# EAGLE design avr_programming_shield_Sockets - DaveO version (EAGLE 6.4)
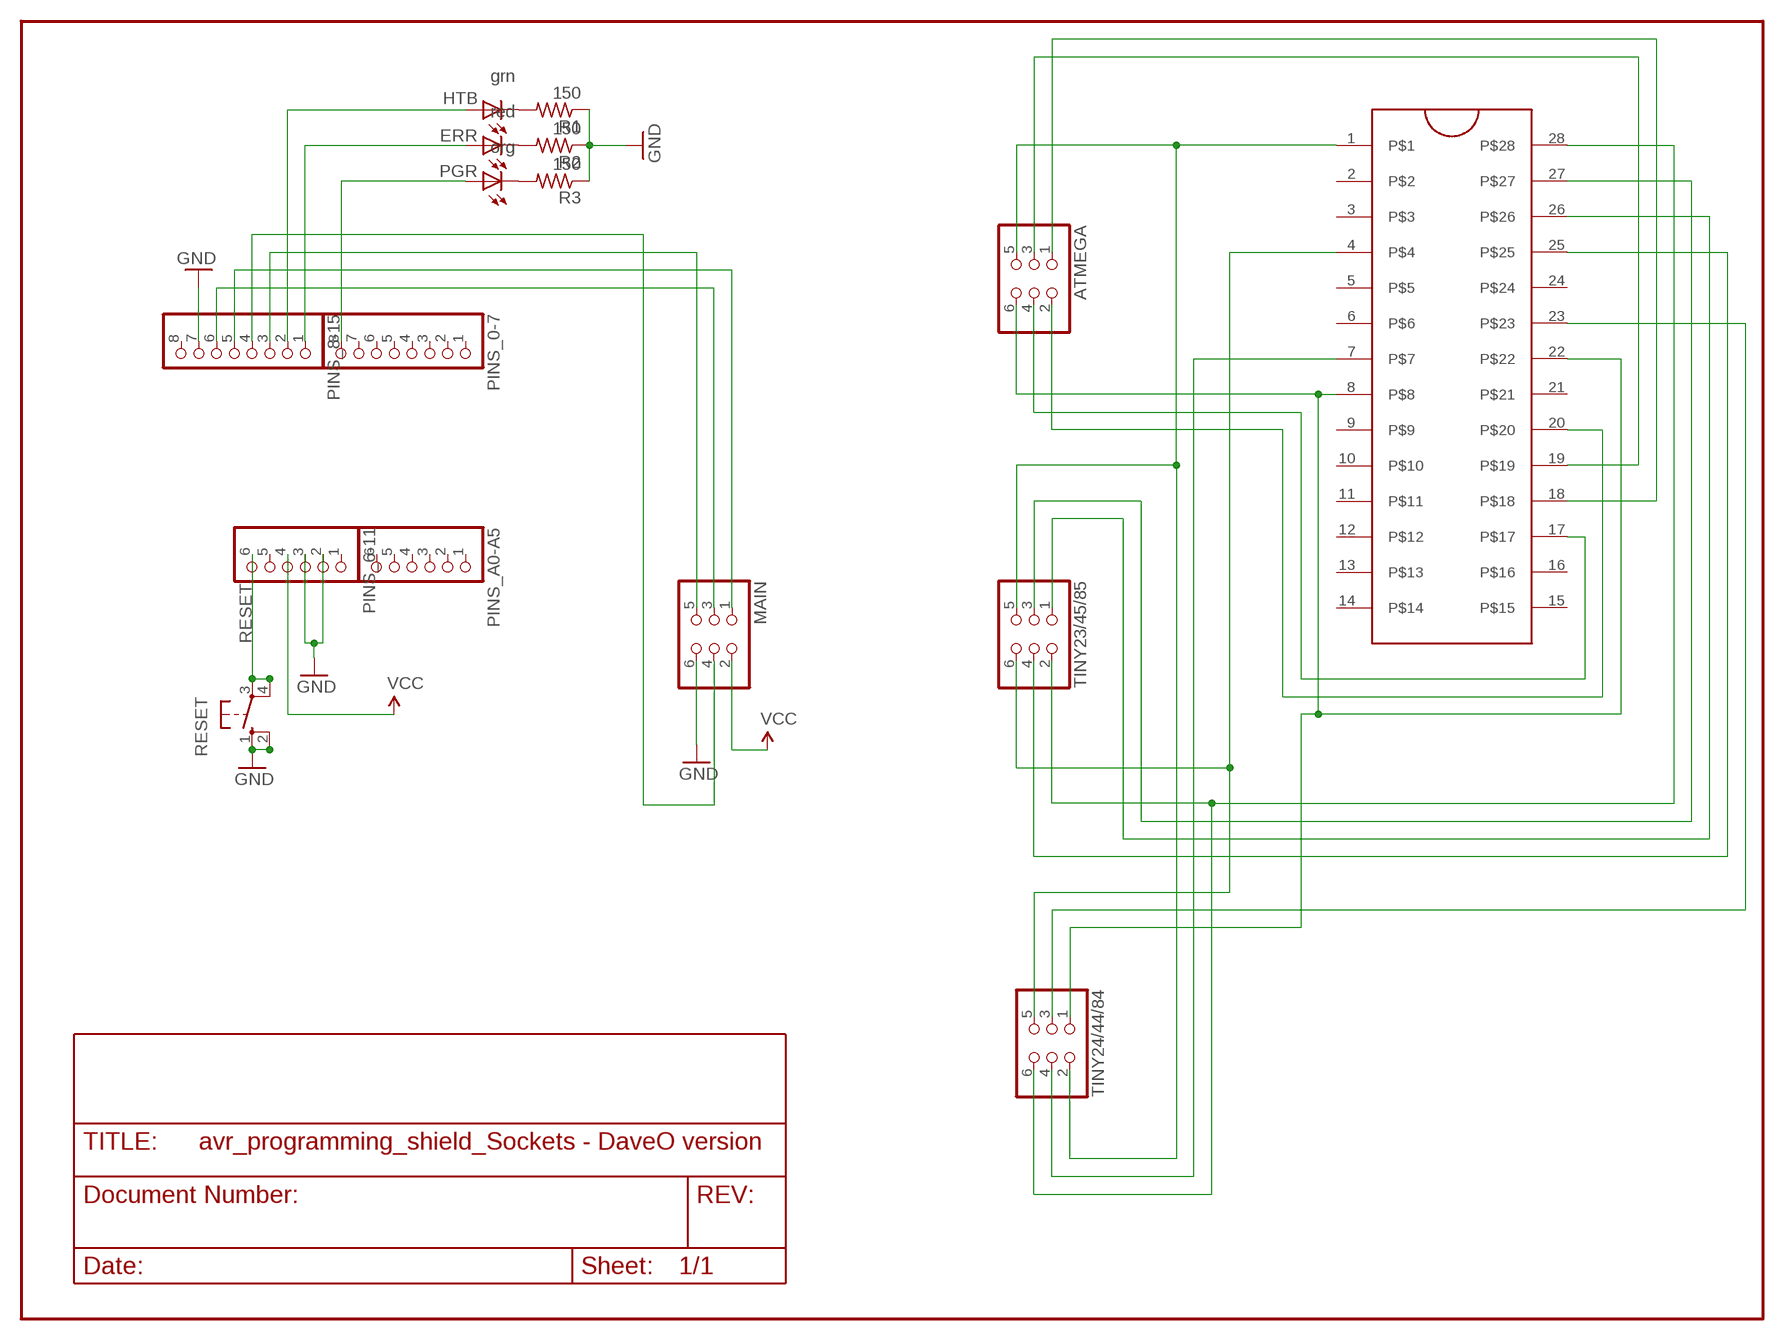
[diagram p0: schematic, sheet 1]

## Parts
ATMEGA  PINHD-2X3  [2X03]
ERR  red  LED3MM  [LED3MM]
HTB  grn  LED3MM  [LED3MM]
MAIN  PINHD-2X3  [2X03]
PGR  org  LED3MM  [LED3MM]
PINS_0-7  PINHD-1X8BIG  [1X08-BIG]
PINS_6-11  PINHD-1X6B  [1X06-BIG]
PINS_8-15  PINHD-1X8BIG  [1X08-BIG]
PINS_A0-A5  PINHD-1X6B  [1X06-BIG]
R1  150  R-US_0204/2V  [0204V]
R2  150  R-US_0204/2V  [0204V]
R3  150  R-US_0204/2V  [0204V]
RESET  10-XX  [B3F-10XX]
TINY23/45/85  PINHD-2X3  [2X03]
TINY24/44/84  PINHD-2X3  [2X03]
U$2  ZIFSOCKET-28-3ZIFFSOCKET-28-3  [DIL28-3-ZIF_SOCKET]

## Nets
328-GND: ATMEGA.6 TINY24/44/84.1 U$2.8 U$2.22
328-MISO: ATMEGA.1 U$2.18
328-SCK: ATMEGA.3 U$2.19
328-VCC: ATMEGA.2 U$2.20
GND [power]: MAIN.6 PINS_6-11.2 PINS_6-11.3 PINS_8-15.7 R1.1 R2.1 R3.1 RESET.1(S) RESET.2(S1)
MISO: MAIN.1 PINS_8-15.5
MOSI: MAIN.4 PINS_8-15.4
N$1: TINY23/45/85.3 U$2.27
N$2: TINY23/45/85.6 TINY24/44/84.5 U$2.4
N$3: ATMEGA.4 U$2.17
N$4: TINY23/45/85.4 U$2.25
N$5: ATMEGA.5 TINY23/45/85.5 TINY24/44/84.2 U$2.1
N$6: ERR.A PINS_8-15.1
N$7: TINY23/45/85.2 TINY24/44/84.6 U$2.28
N$8: HTB.K(C) R1.2
N$9: ERR.K(C) R2.2
N$10: PGR.K(C) R3.2
N$12: TINY23/45/85.1 U$2.26
N$13: PGR.A PINS_0-7.8
N$14: HTB.A PINS_8-15.2
N$16: TINY24/44/84.3 U$2.23
N$19: TINY24/44/84.4 U$2.7
RESET: PINS_6-11.6 RESET.3(P) RESET.4(P1)
RST: MAIN.5 PINS_8-15.3
SCK: MAIN.3 PINS_8-15.6
VCC: MAIN.2 PINS_6-11.4
Unconnected: PINS_0-7.1 PINS_0-7.2 PINS_0-7.3 PINS_0-7.4 PINS_0-7.5 PINS_0-7.6 PINS_0-7.7 PINS_6-11.1 PINS_6-11.5 PINS_8-15.8 PINS_A0-A5.1 PINS_A0-A5.2 PINS_A0-A5.3 PINS_A0-A5.4 PINS_A0-A5.5 PINS_A0-A5.6 U$2.2 U$2.3 U$2.5 U$2.6 U$2.9 U$2.10 U$2.11 U$2.12 U$2.13 U$2.14 U$2.15 U$2.16 U$2.21 U$2.24

## Library data of the parts
ATMEGA MAIN TINY23/45/85 TINY24/44/84 = pinhead:PINHD-2X3: PIN HEADER
ERR HTB PGR = adafruit:LED: LED OSRAM: - CHIPLED LG R971, LG N971, LY N971, LG Q971, LY Q971, LO R971, LY R971 LH N974, LH R974 LS Q976, LO Q976, LY Q976 LO Q996 - Hyper CHIPLED LW Q18S LB Q993, LB Q99A, LB R99A - SideLED LS A670, LO A670, LY A670, LG A670, LP A670 LB A673, LV A673, LT A673, LW A673 LH A674 LY A675 LS A676, LA A676, LO A676, LY A676, LW A676 LS A679, LY A679, LG A679 - Hyper Micro SIDELED® LS Y876, LA Y876, LO Y876, LY Y876 LT Y87S - SmartLED LW L88C, LW L88S LB L89C, LB L89S, LG L890 LS L89K, LO L89K, LY L89K LS L896, LA L896, LO L896, LY L896 - TOPLED LS T670, LO T670, LY T670, LG T670, LP T670 LSG T670, LSP T670, LSY T670, LOP T670, LYG T670 LG T671, LOG T671, LSG T671 LB T673, LV T673, LT T673, LW T673 LH T674 LS T676, LA T676, LO T676, LY T676, LB T676, LH T676, LSB T676, LW T676 LB T67C, LV T67C, LT T67C, LS T67K, LO T67K, LY T67K, LW E67C LS E67B, LA E67B, LO E67B, LY E67B, LB E67C, LV E67C, LT E67C LW T67C LS T679, LY T679, LG T679 LS T770, LO T770, LY T770, LG T770, LP T770 LB T773, LV T773, LT T773, LW T773 LH T774 LS E675, LA E675, LY E675, LS T675 LS T776, LA T776, LO T776, LY T776, LB T776 LHGB T686 LT T68C, LB T68C - Hyper Mini TOPLED® LB M676 - Mini TOPLED Santana® LG M470 LS M47K, LO M47K, LY M47K Source: http://www.osram.convergy.de/
PINS_0-7 PINS_8-15 = adafruit:PINHD-1X8: PIN HEADER
PINS_6-11 PINS_A0-A5 = adafruit:PINHD-1X6: PIN HEADER
R1-R3 = adafruit:R-US_: RESISTOR, American symbol
RESET = switch-omron:10-XX: OMRON SWITCH
U$2 = SparkFun-Connectors:ZIFSOCKET-28-3: Lever-action ZIF socket for 28-pin ICs

## Net classes
1 power: width 0.61 mm

## Board
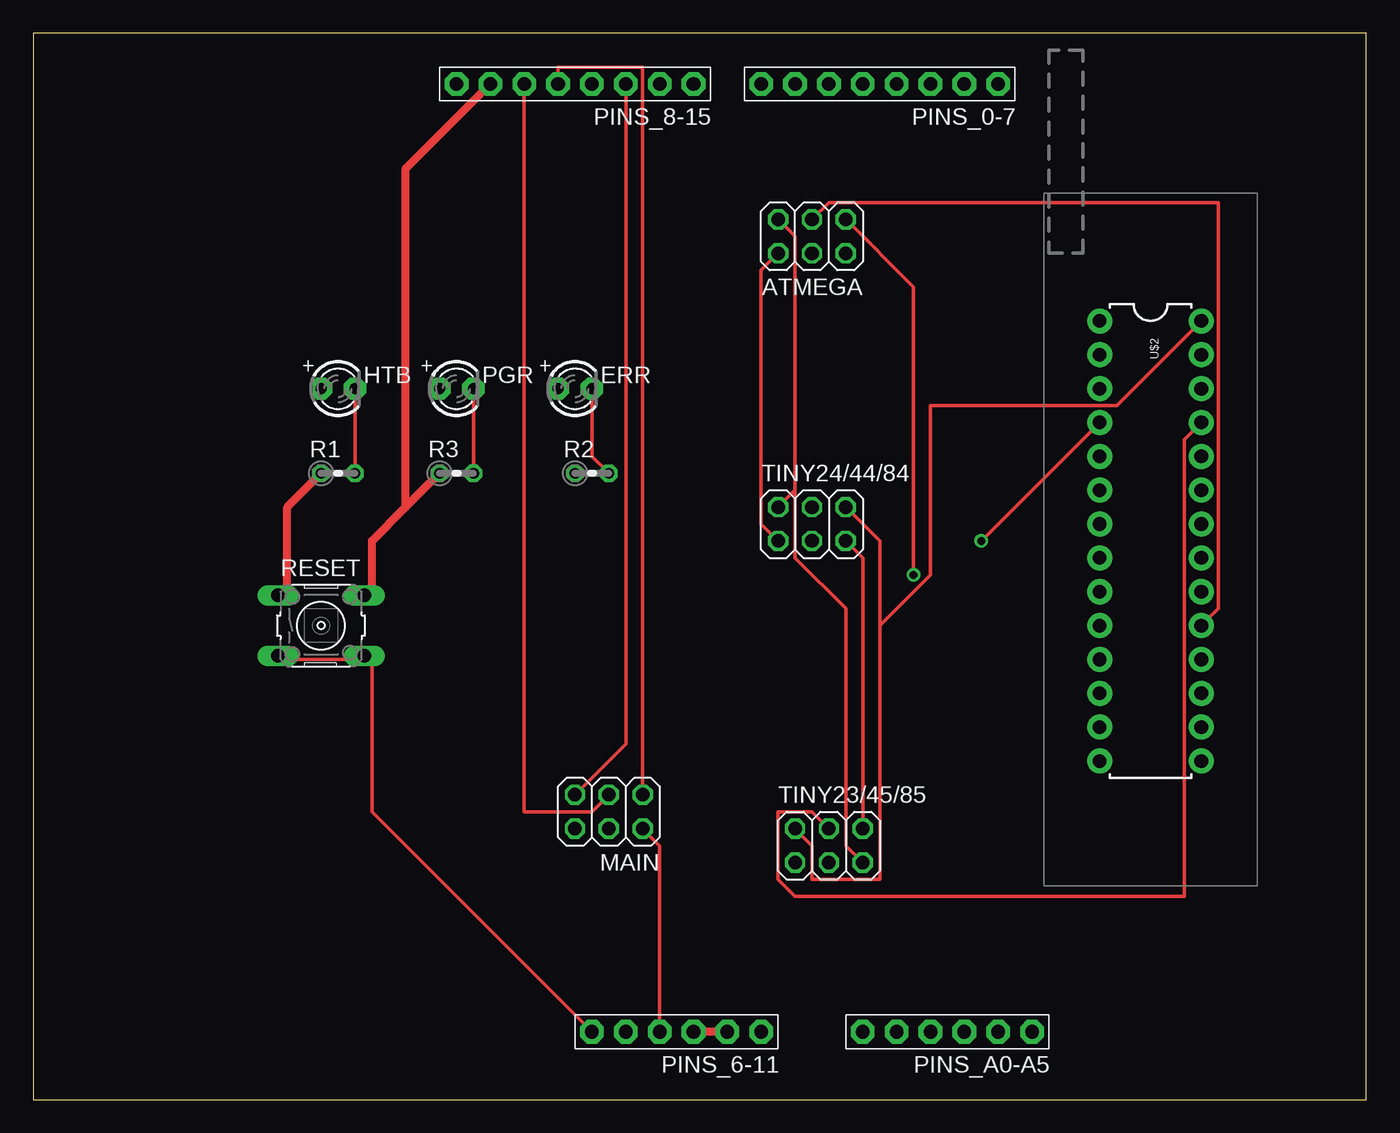
[diagram p1: board, top side]
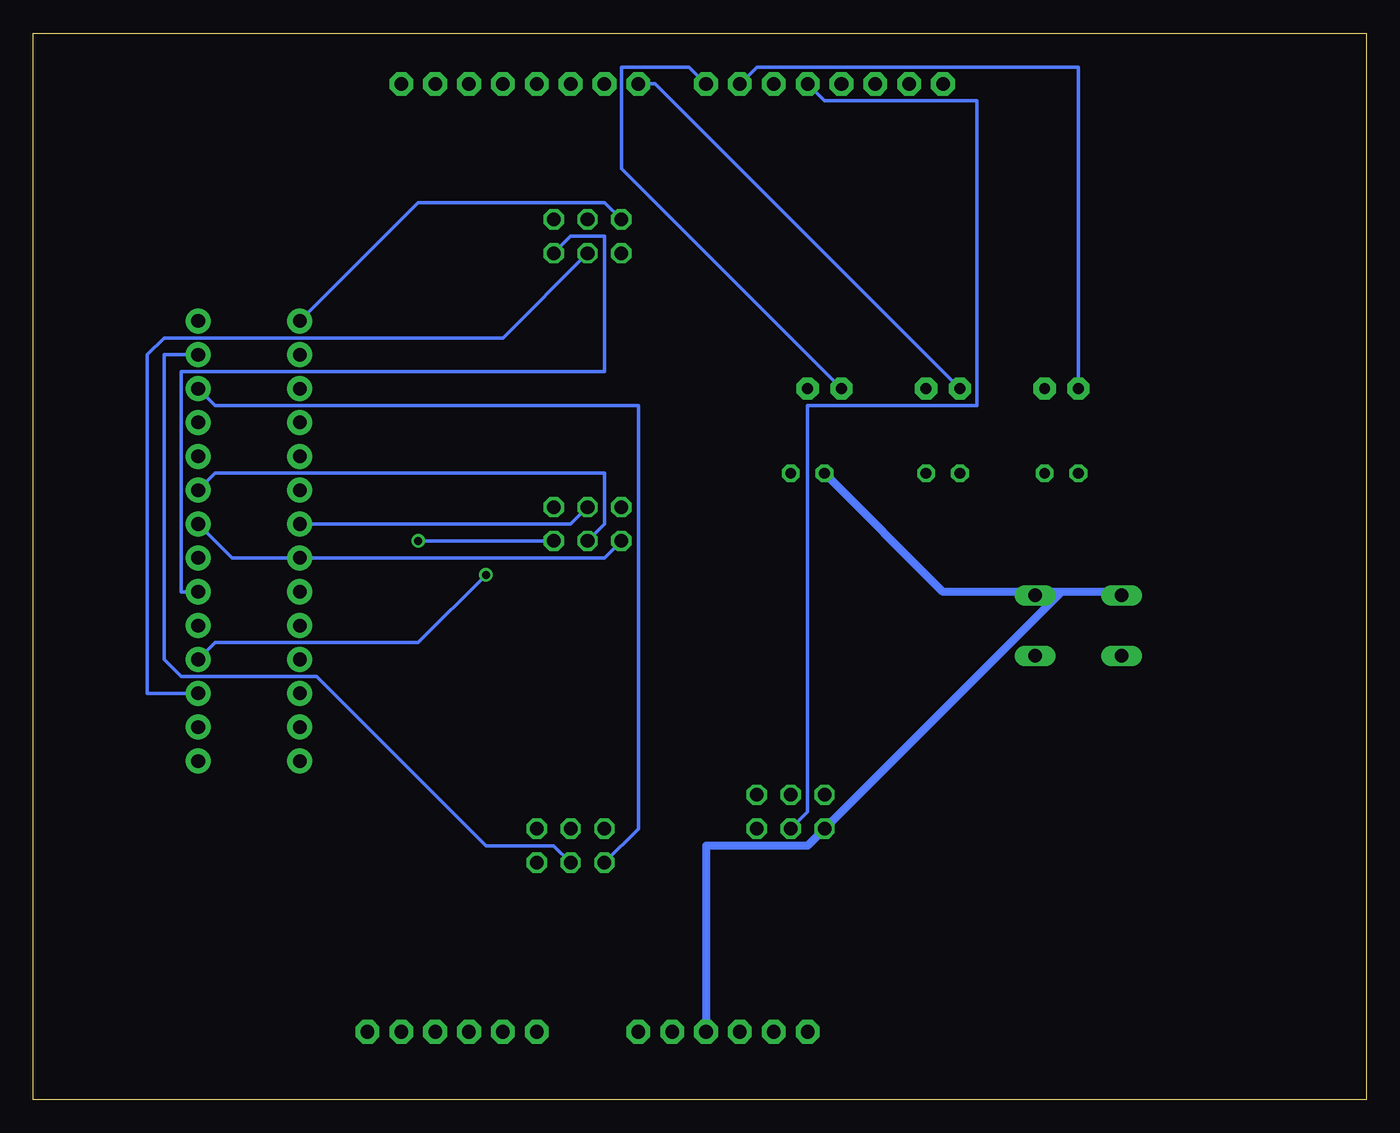
[diagram p2: board, bottom side, seen from below]

Size 100 x 80 mm. Coordinates in mm from the lower left corner, seen from the top.
Outline: 0,0 100,0 100,80 0,80 0,0
Copper layers (1*16): Top 0.035mm / dielectric 1.5mm / Bottom 0.035mm
Design rules "default": minimum track width 10mil, minimum drill 24mil, track to track 8mil, track to pad 8mil, pad to pad 8mil, via to via 8mil, smd to smd 8mil, copper to edge 40mil, drill to drill 8mil, minimum pad ring 10mil, minimum via ring 8mil, stop-mask expansion 4mil, vias tented up to drill 0mil, thermal gap 10mil

### Footprints (pad centres in the part's own frame; a part is rotated, then mirrored left to right if it is on the bottom)
2X03 = drill 1.016 octagon: 1 -2.54,-1.27; 2 -2.54,1.27; 3 0,-1.27; 4 0,1.27; 5 2.54,-1.27; 6 2.54,1.27
LED3MM = drill 0.813 pad 1.676 octagon: A -1.27,0; K 1.27,0
1X08-BIG = drill 1.016 pad 1.778 octagon: 1 -8.89,0; 2 -6.35,0; 3 -3.81,0; 4 -1.27,0; 5 1.27,0; 6 3.81,0; 7 6.35,0; 8 8.89,0
1X06-BIG = drill 1.016 pad 1.778 octagon: 1 -6.35,0; 2 -3.81,0; 3 -1.27,0; 4 1.27,0; 5 3.81,0; 6 6.35,0
0204V = drill 0.813 octagon: 1 -1.27,0; 2 1.27,0
B3F-10XX = drill 1.016 long: 1 -3.251,2.261; 2 3.251,2.261; 3 -3.251,-2.261; 4 3.251,-2.261
DIL28-3-ZIF_SOCKET = drill 1.016 pad 1.88: 1 -16.51,-3.81; 2 -13.97,-3.81; 3 -11.43,-3.81; 4 -8.89,-3.81; 5 -6.35,-3.81; 6 -3.81,-3.81; 7 -1.27,-3.81; 8 1.27,-3.81; 9 3.81,-3.81; 10 6.35,-3.81; 11 8.89,-3.81; 12 11.43,-3.81; 13 13.97,-3.81; 14 16.51,-3.81; 15 16.51,3.81; 16 13.97,3.81; 17 11.43,3.81; 18 8.89,3.81; 19 6.35,3.81; 20 3.81,3.81; 21 1.27,3.81; 22 -1.27,3.81; 23 -3.81,3.81; 24 -6.35,3.81; 25 -8.89,3.81; 26 -11.43,3.81; 27 -13.97,3.81; 28 -16.51,3.81

### Placement (x,y rotation side)
ATMEGA  58.42,64.77 180 top
ERR  40.64,53.34 0 top
HTB  22.86,53.34 0 top
MAIN  43.18,21.59 180 top
PGR  31.75,53.34 0 top
PINS_0-7  63.5,76.2 180 top
PINS_6-11  48.26,5.08 180 top
PINS_8-15  40.64,76.2 180 top
PINS_A0-A5  68.58,5.08 180 top
R1  22.86,46.99 0 top
R2  41.91,46.99 0 top
R3  31.75,46.99 0 top
RESET  21.59,35.56 0 top
TINY23/45/85  59.69,19.05 0 top
TINY24/44/84  58.42,43.18 0 top
U$2  83.82,41.91 270 top

### Tracks (layer width: path | path; a pad name or v marks a point on that pad's centre or on a via)
328-GND
  Top 0.254: ATMEGA.6 54.61,62.23 54.61,43.18 TINY24/44/84.1
  Bottom 0.254: TINY24/44/84.1 57.15,40.64 U$2.8 85.09,40.64 U$2.22
328-MISO  (via drill 0.61)
  Top 0.254: ATMEGA.1 66.04,60.96 v66.04,39.37
  Bottom 0.254: v66.04,39.37 71.12,34.29 86.36,34.29 U$2.18
328-SCK
  Top 0.254: ATMEGA.3 59.69,67.31 88.9,67.31 88.9,36.83 U$2.19
328-VCC
  Bottom 0.254: ATMEGA.2 59.69,64.77 57.15,64.77 57.15,54.61 88.9,54.61 88.9,38.1 U$2.20
GND
  Top 0.61: 27.94,44.45 25.4,41.91 25.4,38.1 RESET.2 | 27.94,44.45 R3.1 | PINS_8-15.7 27.94,69.85 27.94,44.45 | PINS_6-11.2 PINS_6-11.3 | R1.1 19.05,44.45 19.05,38.1 RESET.1
  Bottom 0.61: R2.1 31.75,38.1 25.4,38.1 RESET.2 24.13,38.1 22.86,38.1 | 22.86,38.1 MAIN.6 41.91,19.05 49.53,19.05 PINS_6-11.3 | 22.86,38.1 19.05,38.1 RESET.1
MISO
  Top 0.254: MAIN.1 45.72,77.47 39.37,77.47 PINS_8-15.5
MOSI
  Bottom 0.254: MAIN.4 41.91,21.59 41.91,52.07 29.21,52.07 29.21,74.93 40.64,74.93 PINS_8-15.4
N$1
  Bottom 0.254: TINY23/45/85.3 60.96,19.05 66.04,19.05 78.74,31.75 88.9,31.75 90.17,33.02 90.17,55.88 U$2.27
N$2  (via drill 0.61)
  Top 0.254: TINY23/45/85.6 62.23,40.64 TINY24/44/84.5 | v71.12,41.91 U$2.4
  Bottom 0.254: TINY24/44/84.5 v71.12,41.91
N$3
  Bottom 0.254: ATMEGA.4 64.77,57.15 90.17,57.15 91.44,55.88 91.44,30.48 U$2.17
N$4
  Top 0.254: TINY23/45/85.4 58.42,21.59 55.88,21.59 55.88,16.51 57.15,15.24 86.36,15.24 86.36,49.53 U$2.25
N$5
  Top 0.254: 57.15,45.72 TINY24/44/84.2 | 57.15,45.72 57.15,64.77 ATMEGA.5 | TINY23/45/85.5 60.96,19.05 60.96,36.83 57.15,40.64 57.15,45.72
  Bottom 0.254: U$2.1 71.12,67.31 57.15,67.31 ATMEGA.5
N$6
  Bottom 0.254: ERR.A 55.88,69.85 55.88,77.47 50.8,77.47 PINS_8-15.1
N$7
  Top 0.254: TINY23/45/85.2 58.42,19.05 58.42,16.51 63.5,16.51 63.5,35.56 | 63.5,35.56 63.5,41.91 TINY24/44/84.6 | U$2.28 81.28,52.07 67.31,52.07 67.31,39.37 63.5,35.56
N$8
  Top 0.254: HTB.K R1.2
N$9
  Top 0.254: R2.2 41.91,48.26 ERR.K
N$10
  Top 0.254: PGR.K R3.2
N$12
  Bottom 0.254: TINY23/45/85.1 54.61,20.32 54.61,52.07 86.36,52.07 U$2.26
N$13
  Bottom 0.254: PGR.A 53.34,76.2 PINS_0-7.8
N$14
  Bottom 0.254: HTB.A 21.59,77.47 45.72,77.47 PINS_8-15.2
N$16
  Bottom 0.254: TINY24/44/84.3 57.15,43.18 57.15,46.99 86.36,46.99 U$2.23
N$19
  Bottom 0.254: TINY24/44/84.4 59.69,43.18 U$2.7
RESET
  Top 0.254: RESET.3 19.05,33.02 24.13,33.02 RESET.4 25.4,33.02 25.4,21.59 PINS_6-11.6
RST
  Top 0.254: MAIN.5 44.45,26.67 PINS_8-15.3
SCK
  Top 0.254: MAIN.3 41.91,21.59 36.83,21.59 PINS_8-15.6
VCC
  Top 0.254: MAIN.2 46.99,19.05 PINS_6-11.4